# Altium schematic sheet Main.SchDoc
size A2; SheetNumber: 1; SheetTotal: 1
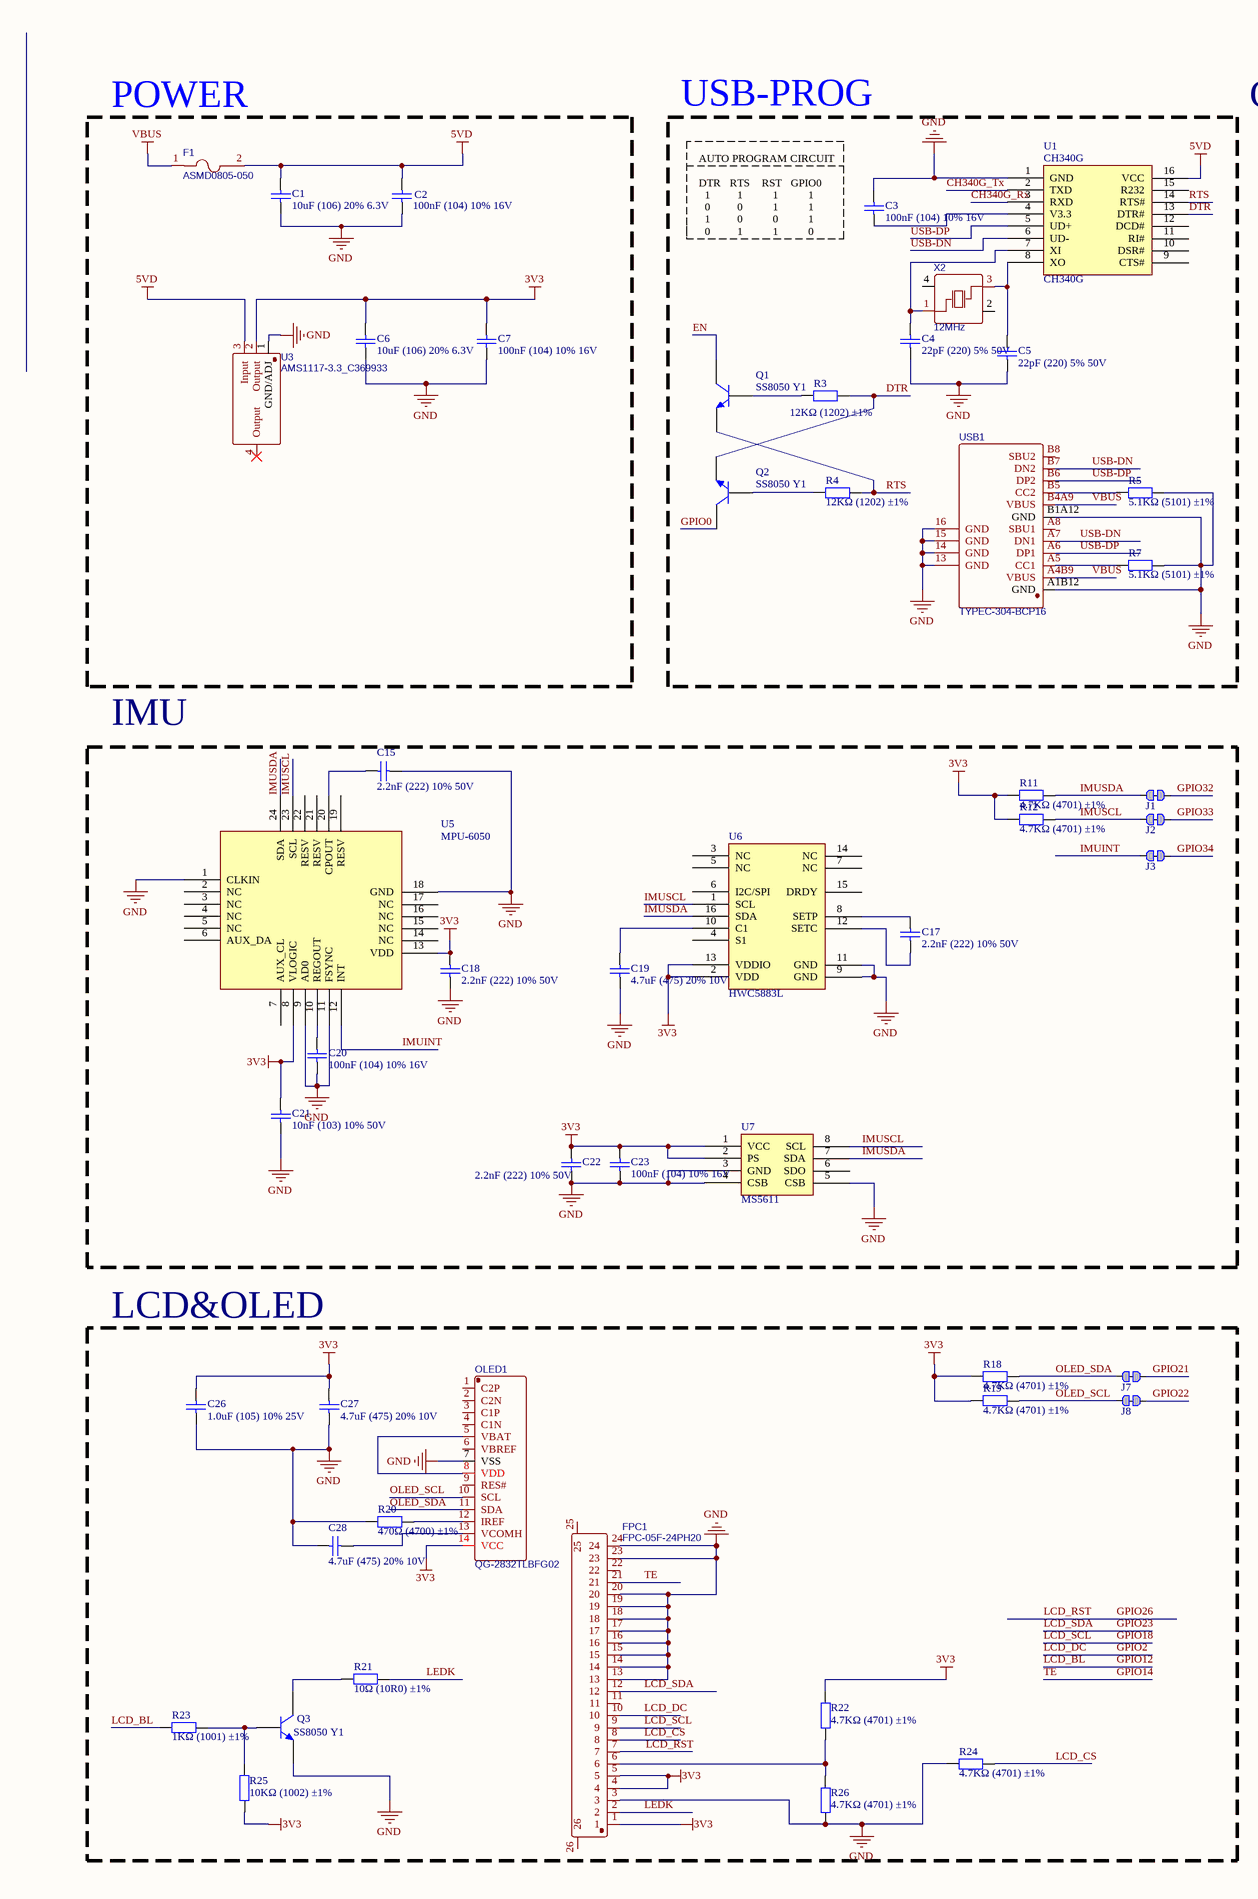
[diagram p0: Main.SchDoc, left]
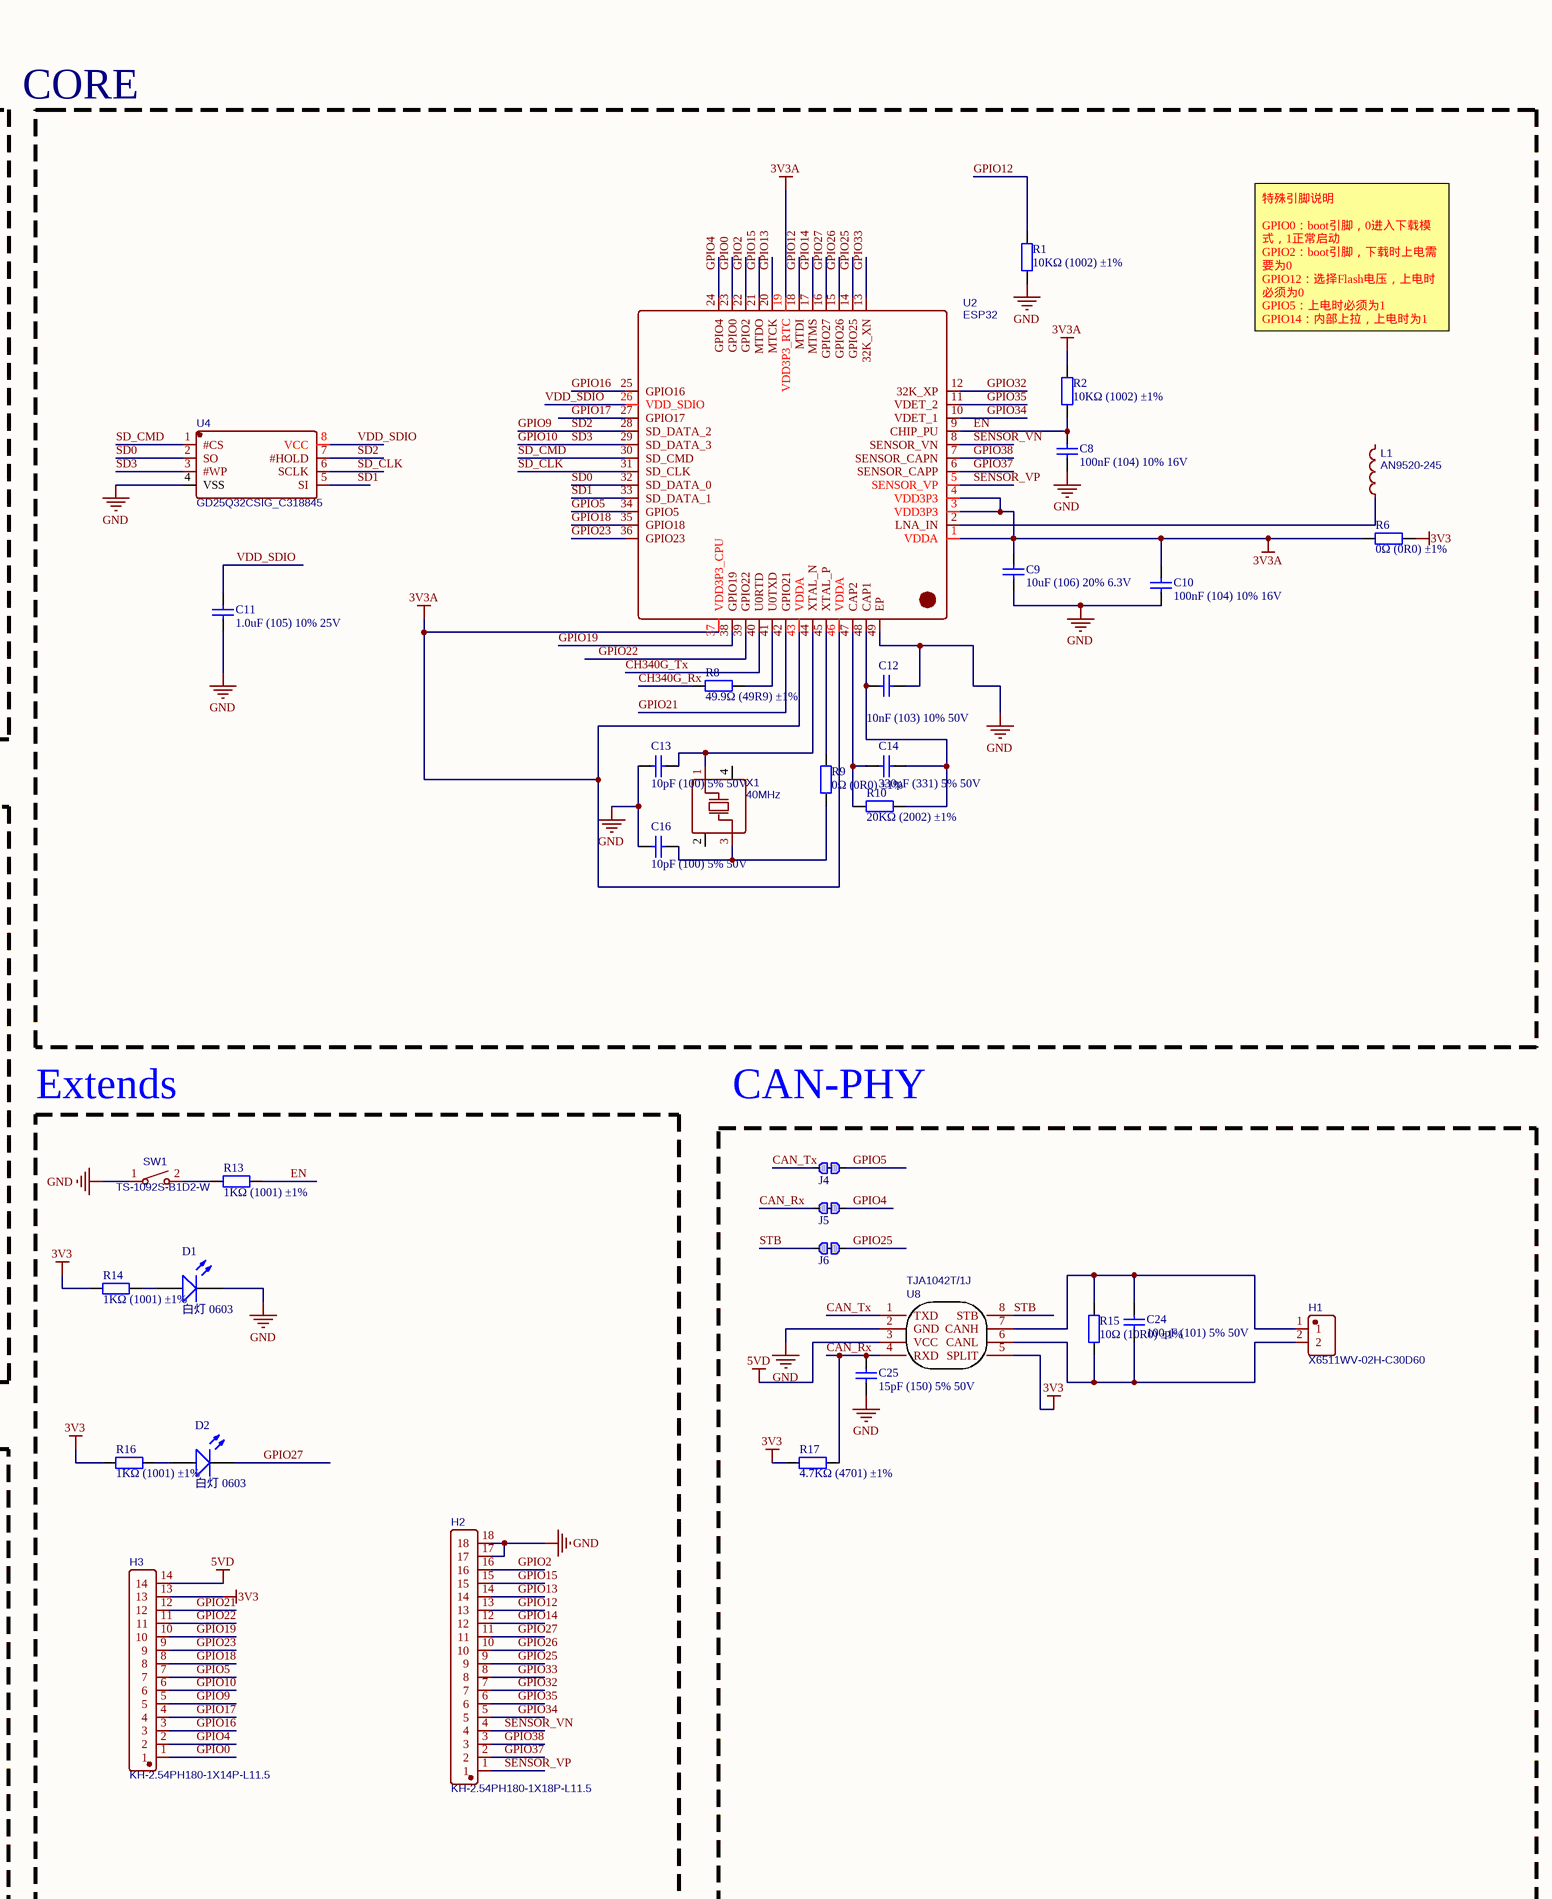
[diagram p1: Main.SchDoc, right]

## Parts
C1  10uF (106) 20% 6.3V  [0402_C]
C2  100nF (104) 10% 16V  [0402_C]
C3  100nF (104) 10% 16V  [0402_C]
C4  22pF (220) 5% 50V  [0402_C]
C5  22pF (220) 5% 50V  [0402_C]
C6  10uF (106) 20% 6.3V  [0402_C]
C7  100nF (104) 10% 16V  [0402_C]
C8  100nF (104) 10% 16V  [0402_C]
C9  10uF (106) 20% 6.3V  [0402_C]
C10  100nF (104) 10% 16V  [0402_C]
C11  1.0uF (105) 10% 25V  [0402_C]
C12  10nF (103) 10% 50V  [0402_C]
C13  10pF (100) 5% 50V  [0402_C]
C14  330pF (331) 5% 50V  [0402_C]
C15  2.2nF (222) 10% 50V  [0402_C]
C16  10pF (100) 5% 50V  [0402_C]
C17  2.2nF (222) 10% 50V  [0402_C]
C18  2.2nF (222) 10% 50V  [0402_C]
C19  4.7uF (475) 20% 10V  [0402_C]
C20  100nF (104) 10% 16V  [0402_C]
C21  10nF (103) 10% 50V  [0402_C]
C22  2.2nF (222) 10% 50V  [0402_C]
C23  100nF (104) 10% 16V  [0402_C]
C24  100pF (101) 5% 50V  [0402_C]
C25  15pF (150) 5% 50V  [0402_C]
C26  1.0uF (105) 10% 25V  [0402_C]
C27  4.7uF (475) 20% 10V  [0402_C]
C28  4.7uF (475) 20% 10V  [0402_C]
D1  白灯 0603  [0603_LED_S1]
D2  白灯 0603  [0603_LED_S1]
F1  ASMD0805-050  [F0805]
FPC1  FPC-05F-24PH20  [FPC-SMD_24P-P0.50_FPC-05F-24PH20]
H1  X6511WV-02H-C30D60  [HDR-TH_2P-P2.54-V-M]
H2  KH-2.54PH180-1X18P-L11.5  [HDR-TH_18P-P2.54-V-M]
H3  KH-2.54PH180-1X14P-L11.5  [HDR-TH_14P-P2.54-V-M]
J1  跳线  [RES_0402]  (value not drawn)
J2  跳线  [RES_0402]  (value not drawn)
J3  跳线  [RES_0402]  (value not drawn)
J4  跳线  [RES_0402]  (value not drawn)
J5  跳线  [RES_0402]  (value not drawn)
J6  跳线  [RES_0402]  (value not drawn)
J7  跳线  [RES_0402]  (value not drawn)
J8  跳线  [RES_0402]  (value not drawn)
L1  AN9520-245  [ANT-SMD_L9.5-W2.1]
OLED1  QG-2832TLBFG02  [OLED-SMD_QG-9616TSWCG02]
Q1  SS8050 Y1  [SOT-23(SOT-23-3)]
Q2  SS8050 Y1  [SOT-23(SOT-23-3)]
Q3  SS8050 Y1  [SOT-23(SOT-23-3)]
R1  10KΩ (1002) ±1%  [0402_R]
R2  10KΩ (1002) ±1%  [0402_R]
R3  12KΩ (1202) ±1%  [0402_R]
R4  12KΩ (1202) ±1%  [0402_R]
R5  5.1KΩ (5101) ±1%  [0402_R]
R6  0Ω (0R0) ±1%  [0402_R]
R7  5.1KΩ (5101) ±1%  [0402_R]
R8  49.9Ω (49R9) ±1%  [0402_R]
R9  0Ω (0R0) ±1%  [0402_R]
R10  20KΩ (2002) ±1%  [0402_R]
R11  4.7KΩ (4701) ±1%  [0402_R]
R12  4.7KΩ (4701) ±1%  [0402_R]
R13  1KΩ (1001) ±1%  [0402_R]
R14  1KΩ (1001) ±1%  [0402_R]
R15  10Ω (10R0) ±1%  [0402_R]
R16  1KΩ (1001) ±1%  [0402_R]
R17  4.7KΩ (4701) ±1%  [0402_R]
R18  4.7KΩ (4701) ±1%  [0402_R]
R19  4.7KΩ (4701) ±1%  [0402_R]
R20  470Ω (4700) ±1%  [0402_R]
R21  10Ω (10R0) ±1%  [0402_R]
R22  4.7KΩ (4701) ±1%  [0402_R]
R23  1KΩ (1001) ±1%  [0402_R]
R24  4.7KΩ (4701) ±1%  [0402_R]
R25  10KΩ (1002) ±1%  [0402_R]
R26  4.7KΩ (4701) ±1%  [0402_R]
SW1  TS-1092S-B1D2-W  [SW-SMD_L6.1-W3.6-LS7.9]
U1  CH340G  [SOIC-16_150mil]
U2  ESP32  [QFN-48-EP3.8]
U3  AMS1117-3.3_C369933  [SOT-223-3_L6.5-W3.4-P2.30-LS7.0-BR]
U4  GD25Q32CSIG_C318845  [SOIC-8_L5.3-W5.3-P1.27-LS8.0-BL]
U5  MPU-6050  [QFN-24_4x4x05P]
U6  HWC5883L  [LPCC-16_L3.0-W3.0-P0.50-BL]
U7  MS5611  [MS5611]
U8  TJA1042T/1J  [SOIC-8_L5.0-W4.0-P1.27-LS6.0-BL]
USB1  TYPEC-304-BCP16  [USB-C-SMD_TYPEC-304-BCP16]
X1  40MHz  [OSC-SMD_4P-L3.2-W2.5-BL]
X2  12MHz  [OSC-SMD_4P-L3.2-W2.5-BL]

## Blocks framed on the sheet
POWER: C1 C2 C6 C7 F1 U3
IMU: C15 C17-C23 J1-J3 R11 R12 U5-U7
LCD&OLED: C26-C28 FPC1 J7 J8 OLED1 Q3 R18-R26

## Nets
3V3: C6.2 C7.2 C18.2 C21.2 C22.2 C23.2 C26.2 C27.2 FPC1.1 FPC1.4 FPC1.5 H3.13 OLED1.14(VCC) R6.2 R11.1 R12.1 R14.1 R16.1 R17.1 R18.1 R19.1 R22.2 R25.1 U3.2(Output) U5.8(VLOGIC) U5.13(VDD) U6.2(VDD) U6.13(VDDIO) U7.1(VCC) U7.2(PS) U8.5(SPLIT)
3V3A: C9.2 C10.2 R2.2 R6.1 U2.1(VDDA) U2.3(VDD3P3) U2.4(VDD3P3) U2.19(VDD3P3_RTC) U2.37(VDD3P3_CPU) U2.43(VDDA) U2.46(VDDA)
5VD: C1.2 C2.2 F1.2 H3.14 U1.16(VCC) U3.3(Input) U8.3(VCC)
GND: C1.1 C2.1 C3.2 C4.1 C5.1 C6.1 C7.1 C8.1 C9.1 C10.1 C11.1 C12.2 C13.1 C15.2 C16.1 C18.1 C19.1 C20.1 C21.1 C22.1 C23.1 C25.1 C26.1 C27.1 C28.1 D1.K FPC1.3 FPC1.13 FPC1.14 FPC1.15 FPC1.16 FPC1.17 FPC1.18 FPC1.19 FPC1.20 FPC1.23 FPC1.24 H2.17 H2.18 OLED1.7(VSS) Q3.2(E) R1.1 R5.2 R7.2 R20.1 R24.1 R26.1 SW1.1 U1.1(GND) U2.49(EP) U3.1(GND/ADJ) U4.4(VSS) U5.1(CLKIN) U5.9(AD0) U5.11(FSYNC) U5.18(GND) U6.9(GND) U6.11(GND) U7.3(GND) U7.4(CSB) U7.5(CSB) U8.2(GND) USB1.13(GND) USB1.14(GND) USB1.15(GND) USB1.16(GND) USB1.A1B12(GND) USB1.B1A12(GND)
VBUS: F1.1 USB1.A4B9(VBUS) USB1.B4A9(VBUS)
CAN_Rx: C25.2 J5.1 R17.2 U8.4(RXD)
CAN_Tx: J4.1 U8.1(TXD)
CH340G_Rx: R8.1 U1.3(RXD)
CH340G_Tx: U1.2(TXD) U2.40(U0RTD)
DTR: Q2.2(E) R3.2 U1.13(DTR#)
EN: C8.2 Q1.3(C) R2.1 R13.2 U2.9(CHIP_PU)
GPIO0: H3.1 Q2.3(C) U2.23(GPIO0)
GPIO2: FPC1.10 H2.16 U2.22(GPIO2)  [also labelled LCD_DC]
GPIO4: H3.2 J5.2 U2.24(GPIO4)
GPIO5: H3.7 J4.2 U2.34(GPIO5)
GPIO9: H3.5 U2.28(SD_DATA_2) U4.7(#HOLD)  [also labelled SD2]
GPIO10: H3.6 U2.29(SD_DATA_3) U4.3(#WP)  [also labelled SD3]
GPIO12: H2.13 R1.2 R23.1 U2.18(MTDI)  [also labelled LCD_BL]
GPIO13: H2.14 U2.20(MTCK)
GPIO14: FPC1.21 H2.12 U2.17(MTMS)  [also labelled TE]
GPIO15: H2.15 U2.21(MTDO)
GPIO16: H3.3 U2.25(GPIO16)
GPIO17: H3.4 U2.27(GPIO17)
GPIO18: FPC1.9 H3.8 U2.35(GPIO18)  [also labelled LCD_SCL]
GPIO19: H3.10 U2.38(GPIO19)
GPIO21: H3.12 J7.2 U2.42(GPIO21)
GPIO22: H3.11 J8.2 U2.39(GPIO22)
GPIO23: FPC1.12 H3.9 U2.36(GPIO23)  [also labelled LCD_SDA]
GPIO25: H2.9 J6.2 U2.14(GPIO25)
GPIO26: FPC1.7 H2.10 U2.15(GPIO26)  [also labelled LCD_RST]
GPIO27: D2.K H2.11 U2.16(GPIO27)
GPIO32: H2.7 J1.2 U2.12(32K_XP)
GPIO33: H2.8 J2.2 U2.13(32K_XN)
GPIO34: H2.5 J3.2 U2.10(VDET_1)
GPIO35: H2.6 U2.11(VDET_2)
GPIO37: H2.2 U2.6(SENSOR_CAPP)
GPIO38: H2.3 U2.7(SENSOR_CAPN)
IMUINT: J3.1 U5.12(INT)
IMUSCL: J2.1 R12.2 U5.23(SCL) U6.1(SCL) U7.8(SCL)
IMUSDA: J1.1 R11.2 U5.24(SDA) U6.16(SDA) U7.7(SDA)
LCD_CS: FPC1.8 R24.2
LEDK: FPC1.2 R21.2
OLED_SCL: J8.1 OLED1.10(SCL) R19.2
OLED_SDA: J7.1 OLED1.11(SDA) R18.2
RTS: Q1.2(E) R4.2 U1.14(RTS#)
SD0: U2.32(SD_DATA_0) U4.2(SO)
SD1: U2.33(SD_DATA_1) U4.5(SI)
SD_CLK: U2.31(SD_CLK) U4.6(SCLK)
SD_CMD: U2.30(SD_CMD) U4.1(#CS)
SENSOR_VN: H2.4 U2.8(SENSOR_VN)
SENSOR_VP: H2.1 U2.5(SENSOR_VP)
STB: J6.1 U8.8(STB)
USB-DN: U1.6(UD-) USB1.A7(DN1) USB1.B7(DN2)
USB-DP: U1.5(UD+) USB1.A6(DP1) USB1.B6(DP2)
VDD_SDIO: C11.2 U2.26(VDD_SDIO) U4.8(VCC)
NetC3_1: C3.1 U1.4(V3.3)
NetC4_2: C4.2 U1.7(XI) X2.1(OSC1)
NetC5_2: C5.2 U1.8(XO) X2.3(OSC2)
NetC12_1: C12.1 C14.1 R10.2 U2.48(CAP1)
NetC13_2: C13.2 U2.44(XTAL_N) X1.1(OSC1)
NetC14_2: C14.2 R10.1 U2.47(CAP2)
NetC15_1: C15.1 U5.20(CPOUT)
NetC16_2: C16.2 R9.1 X1.3(OSC2)
NetC17_1: C17.1 U6.12(SETC)
NetC17_2: C17.2 U6.8(SETP)
NetC19_2: C19.2 U6.10(C1)
NetC20_2: C20.2 U5.10(REGOUT)
NetC24_1: C24.1 H1.2 R15.1 U8.6(CANL)
NetC24_2: C24.2 H1.1 R15.2 U8.7(CANH)
NetC28_2: C28.2 OLED1.13(VCOMH)
NetD1_A: D1.A R14.2
NetD2_A: D2.A R16.2
NetFPC1_6: FPC1.6 R22.1 R26.2
NetL1_1: L1.1 U2.2(LNA_IN)
NetOLED1_5: OLED1.5(VBAT) OLED1.8(VDD)
NetOLED1_12: OLED1.12(IREF) R20.2
NetQ1_1: Q1.1(B) R3.1
NetQ2_1: Q2.1(B) R4.1
NetQ3_1: Q3.1(B) R23.2 R25.2
NetQ3_3: Q3.3(C) R21.1
NetR5_1: R5.1 USB1.B5(CC2)
NetR7_1: R7.1 USB1.A5(CC1)
NetR8_2: R8.2 U2.41(U0TXD)
NetR9_2: R9.2 U2.45(XTAL_P)
NetR13_1: R13.1 SW1.2

Not connected (* = marked no-connect by the designer): FPC1 11 22 25 26; L1 2; OLED1 1(C2P) 2(C2N) 3(C1P) 4(C1N) 6(VBREF) 9(RES#); U1 9(CTS#) 10(DSR#) 11(RI#) 12(DCD#) 15(R232); U3 4(Output)*; U5 2(NC) 3(NC) 4(NC) 5(NC) 6(AUX_DA) 7(AUX_CL) 14(NC) 15(NC) 16(NC) 17(NC) 19(RESV) 21(RESV) 22(RESV); U6 3(NC) 4(S1) 5(NC) 6(I2C/SPI) 7(NC) 14(NC) 15(DRDY); U7 6(SDO); USB1 A8(SBU1) B8(SBU2); X1 2(GND) 4(GND); X2 2(GND) 4(GND)

## Notes on the sheet
- Text
- USB-PROG
- CORE
- (near C3) AUTO PROGRAM CIRCUIT
  DTR   RTS    RST   GPIO0
  1         1          1          1
  0         0          1          1
  1         0          0          1
  0         1          1          0
- 特殊引脚说明
  GPIO0：boot引脚，0进入下载模式，1正常启动
  GPIO2：boot引脚，下载时上电需要为0
  GPIO12：选择Flash电压，上电时必须为0
  GPIO5：上电时必须为1
  GPIO14：内部上拉，上电时为1
  GPIO15：上电时必须为1
- Extends
- CAN-PHY

## Library data of the parts
C1 C6 C9 = 0402 10uF (106) 20% 6.3V: 贴片电容; ComponentLink1Description: 供应商链接; ComponentLink1URL: http://www.szlcsc.com/product/details_16204.html; Package: 0402; Supplier: LC; SuppliersPartNumber: C15525
C2 C3 C7 C8 C10 C20 C23 = 0402 100nF (104) 10% 16V: 贴片电容; ComponentLink1Description: 供应商链接; ComponentLink1URL: http://www.szlcsc.com/product/details_1877.html; Package: 0402; Supplier: LC; SuppliersPartNumber: C1525
C4 C5 = 0402 22pF (220) 5% 50V: 贴片电容; ComponentLink1Description: 供应商链接; ComponentLink1URL: http://www.szlcsc.com/product/details_1907.html; Package: 0402; Supplier: LC; SuppliersPartNumber: C1555
C11 C26 = 0402 1.0uF (105) 10% 25V: 贴片电容; ComponentLink1Description: 供应商链接; ComponentLink1URL: http://www.szlcsc.com/product/details_53938.html; Package: 0402; Supplier: LC; SuppliersPartNumber: C52923
C12 C21 = 0402 10nF (103) 10% 50V: 贴片电容; ComponentLink1Description: 供应商链接; ComponentLink1URL: http://www.szlcsc.com/product/details_15869.html; Package: 0402; Supplier: LC; SuppliersPartNumber: C15195
C13 C16 = 0402 10pF (100) 5% 50V: 贴片电容; ComponentLink1Description: 供应商链接; ComponentLink1URL: http://www.szlcsc.com/product/details_33914.html; Package: 0402; Supplier: LC; SuppliersPartNumber: C32949
C14 = 0402 330pF (331) 5% 50V: 贴片电容; ComponentLink1Description: 供应商链接; ComponentLink1URL: http://www.szlcsc.com/product/details_14182.html; Package: 0402; Supplier: LC; SuppliersPartNumber: C13533
C15 C17 C18 C22 = 0402 2.2nF (222) 10% 50V: 贴片电容; ComponentLink1Description: 供应商链接; ComponentLink1URL: http://www.szlcsc.com/product/details_1883.html; Package: 0402; Supplier: LC; SuppliersPartNumber: C1531
C19 C27 C28 = 0402 4.7uF (475) 20% 10V: 贴片电容; ComponentLink1Description: 供应商链接; ComponentLink1URL: http://www.szlcsc.com/product/details_24469.html; Package: 0402; Supplier: LC; SuppliersPartNumber: C23733
C24 = 0402 100pF (101) 5% 50V: 贴片电容; ComponentLink1Description: 供应商链接; ComponentLink1URL: http://www.szlcsc.com/product/details_1898.html; Package: 0402; Supplier: LC; SuppliersPartNumber: C1546
C25 = 0402 15pF (150) 5% 50V: 贴片电容; ComponentLink1Description: 供应商链接; ComponentLink1URL: http://www.szlcsc.com/product/details_1900.html; Package: 0402; Supplier: LC; SuppliersPartNumber: C1548
D1 D2 = 0603 白灯: 发光二极管; ComponentLink1Description: 供应商链接; ComponentLink1URL: http://www.szlcsc.com/product/details_2663.html; Package: 0603; Supplier: LC; SuppliersPartNumber: C2290
F1 = ASMD0805-050: BOM_Manufacturer: JDTFUSE; Contributor: LCSC; BOM_Supplier: LCSC; BOM_Manufacturer Part: ASMD0805-050; BOM_Supplier Part: C135329; BOM_JLCPCB Part Class: Extended Part; spicePre: F; spiceSymbolName: ASMD0805-050
FPC1 = FPC-05F-24PH20: FPC24脚; BOM_Manufacturer: XUNPU(讯普); Contributor: LCSC; BOM_Supplier: LCSC; BOM_Supplier Part: C2856805; BOM_Manufacturer Part: FPC-05F-24PH20; spicePre: F; spiceSymbolName: FPC-05F-24PH20
H1 = HDR-2P: BOM_Manufacturer: XKB Connectivity; Contributor: LCSC; BOM_Supplier: LCSC; BOM_Supplier Part: C706874; BOM_Manufacturer Part: X6511WV-02H-C30D60; BOM_JLCPCB Part Class: Extended Part; spicePre: H; spiceSymbolName: X6511WV-02H-C30D60
H2 = HDR-18P: BOM_Manufacturer: kinghelm(金航标); Contributor: LCSC; BOM_Supplier: LCSC; BOM_Supplier Part: C2905492; BOM_Manufacturer Part: KH-2.54PH180-1X18P-L11.5; spicePre: H; spiceSymbolName: KH-2.54PH180-1X18P-L11.5
H3 = HDR-14P: 排针; BOM_Manufacturer: kinghelm(金航标); Contributor: LCSC; BOM_Supplier: LCSC; BOM_Supplier Part: C2905490; BOM_Manufacturer Part: KH-2.54PH180-1X14P-L11.5; spicePre: H; spiceSymbolName: KH-2.54PH180-1X14P-L11.5
J1-J8 = 跳线: Resistor; Published: 8-Jun-2000; LatestRevisionDate: 17-Jul-2002; LatestRevisionNote: Re-released for DXP Platform.; PackageReference: AXIAL-0.4; Publisher: Altium Limited; PackageDescription: Axial Device, Thru-Hole; 2 Leads; 0.4 in Pin Spacing
L1 = AN9520-245: 陶瓷wifi/bt天线; BOM_Manufacturer: Rainsun; BOM_Supplier: LCSC; BOM_Manufacturer Part: AN9520-245; BOM_Supplier Part: C99665; BOM_JLCPCB Part Class: Extended Part; spicePre: L; spiceSymbolName: AN9520-245
OLED1 = OLED: BOM_Manufacturer: Allvision; Contributor: LCSC; BOM_Supplier: LCSC; BOM_Manufacturer Part: QG-2832TLBFG02; BOM_Supplier Part: C91220; BOM_JLCPCB Part Class: Extended Part; spicePre: O; spiceSymbolName: QG-2832TLBFG02
Q1-Q3 = SOT-23 SS8050 Y1: 三极管; ComponentLink1Description: 供应商链接; ComponentLink1URL: http://www.szlcsc.com/product/details_2507.html; Package: SOT-23; Supplier: LC; SuppliersPartNumber: C2150
R1 R2 R25 = 0402 10KΩ (1002) 1%: 贴片电阻; ComponentLink1Description: 供应商链接; ComponentLink1URL: http://www.szlcsc.com/product/details_26487.html; Package: 0402; Supplier: LC; SuppliersPartNumber: C25744
R3 R4 = 0402 12KΩ (1202) 1%: 贴片电阻; ComponentLink1Description: 供应商链接; ComponentLink1URL: http://www.szlcsc.com/product/details_26495.html; Package: 0402; Supplier: LC; SuppliersPartNumber: C25752
R5 R7 = 0402 5.1KΩ (5101) 1%: 贴片电阻; ComponentLink1Description: 供应商链接; ComponentLink1URL: http://www.szlcsc.com/product/details_26648.html; Package: 0402; Supplier: LC; SuppliersPartNumber: C25905
R6 R9 = 0402 0Ω (0R0) 1%: 贴片电阻; ComponentLink1Description: 供应商链接; ComponentLink1URL: http://www.szlcsc.com/product/details_17853.html; Package: 0402; Supplier: LC; SuppliersPartNumber: C17168
R8 = 0402 49.9Ω (49R9) 1%: 贴片电阻; ComponentLink1Description: 供应商链接; ComponentLink1URL: http://www.szlcsc.com/product/details_25863.html; Package: 0402; Supplier: LC; SuppliersPartNumber: C25120
R10 = 0402 20KΩ (2002) 1%: 贴片电阻; ComponentLink1Description: 供应商链接; ComponentLink1URL: http://www.szlcsc.com/product/details_26508.html; Package: 0402; Supplier: LC; SuppliersPartNumber: C25765
R11 R12 R17-R19 R22 R24 R26 = 0402 4.7KΩ (4701) 1%: 贴片电阻; ComponentLink1Description: 供应商链接; ComponentLink1URL: http://www.szlcsc.com/product/details_26643.html; Package: 0402; Supplier: LC; SuppliersPartNumber: C25900
R13 R14 R16 R23 = 0402 1KΩ (1001) 1%: 贴片电阻; ComponentLink1Description: 供应商链接; ComponentLink1URL: http://www.szlcsc.com/product/details_12256.html; Package: 0402; Supplier: LC; SuppliersPartNumber: C11702
R15 R21 = 0402 10Ω (10R0) 1%: 贴片电阻; ComponentLink1Description: 供应商链接; ComponentLink1URL: http://www.szlcsc.com/product/details_25820.html; Package: 0402; Supplier: LC; SuppliersPartNumber: C25077
R20 = 0402 470Ω (4700) 1%: 贴片电阻; ComponentLink1Description: 供应商链接; ComponentLink1URL: http://www.szlcsc.com/product/details_25860.html; Package: 0402; Supplier: LC; SuppliersPartNumber: C25117
SW1 = TS-1092S-B1D2-W: 触控开关; BOM_Manufacturer: Yuandi(台湾元迪); Contributor: LCSC; BOM_Supplier: LCSC; BOM_Supplier Part: C782859; BOM_Manufacturer Part: TS-1092S-B1D2-W; BOM_JLCPCB Part Class: Extended Part; spicePre: S; spiceSymbolName: TS-1092S-B1D2-W
U1 = CH340G_[C14267]: USB; ComponentLink1Description: 供应商链接; ComponentLink1URL: http://www.szlcsc.com/product/details_14927.html; Package: SOIC-16_150mil; Supplier: LC; SuppliersPartNumber: C14267
U2 = ESP32: BOM_Manufacturer: ESPRESSIF; BOM_Supplier: LCSC; BOM_Manufacturer Part: ESP32; BOM_Supplier Part: C80134; BOM_JLCPCB Part Class: Extended Part; spicePre: U; spiceSymbolName: ESP32
U3 = AMS1117-3.3: BOM_Manufacturer: KEXIN; Contributor: LCSC; BOM_Paste Type: expand; BOM_Supplier: LCSC; BOM_Supplier Part: C369933; BOM_Manufacturer Part: AMS1117-3.3; spicePre: U; spiceSymbolName: AMS1117-3.3_C369933
U4 = GD25Q32CSIG_C318845: BOM_Manufacturer: GigaDevice Semicon Beijing; Contributor: LCSC; BOM_Supplier: LCSC; BOM_Supplier Part: C318845; BOM_Manufacturer Part: GD25Q32CSIG; BOM_JLCPCB Part Class: Extended Part; spicePre: U; spiceSymbolName: GD25Q32CSIG_C318845
U5 = MPU-6050_[C24112]: 传感器; ComponentLink1Description: 供应商链接; ComponentLink1URL: http://www.szlcsc.com/product/details_24852.html; Package: QFN-24_4x4x05P; Supplier: LC; SuppliersPartNumber: C24112
U6 = HMC5883L
U8 = TJA1042T/1J: CAN芯片; BOM_Manufacturer: NXP; BOM_Supplier: LCSC; BOM_Manufacturer Part: TJA1042T/1J; BOM_Supplier Part: C53670; BOM_JLCPCB Part Class: Extended Part; spicePre: U; spiceSymbolName: TJA1042T/1J
USB1 = TYPEC-304-BCP16: BOM_Manufacturer: XUNPU; Contributor: LCSC; BOM_Supplier: LCSC; BOM_Supplier Part: C720629; BOM_Manufacturer Part: TYPEC-304-BCP16; spicePre: U; spiceSymbolName: TYPEC-304-BCP16
X1 = 40MHz: 有源晶振; BOM_Manufacturer: TKD; BOM_Manufacturer Part: 3225-20MHZ-15PF-10PPM; nameAlias: Frequency; Contributor: LCSC; BOM_Supplier: LCSC; BOM_Supplier Part: C337680; spicePre: X; spiceSymbolName: 3225-20MHZ-15PF-10PPM
X2 = 12MHz: 无源晶振; BOM_Manufacturer: YXC; BOM_Manufacturer Part: X322512MSB4SI; nameAlias: Frequency; BOM_Supplier: LCSC; BOM_Supplier Part: C9002; BOM_JLCPCB Part Class: Basic Part; spicePre: X; spiceSymbolName: X322512MSB4SI